# Altium schematic sheet Agilent_OCXO.SchDoc
size A3
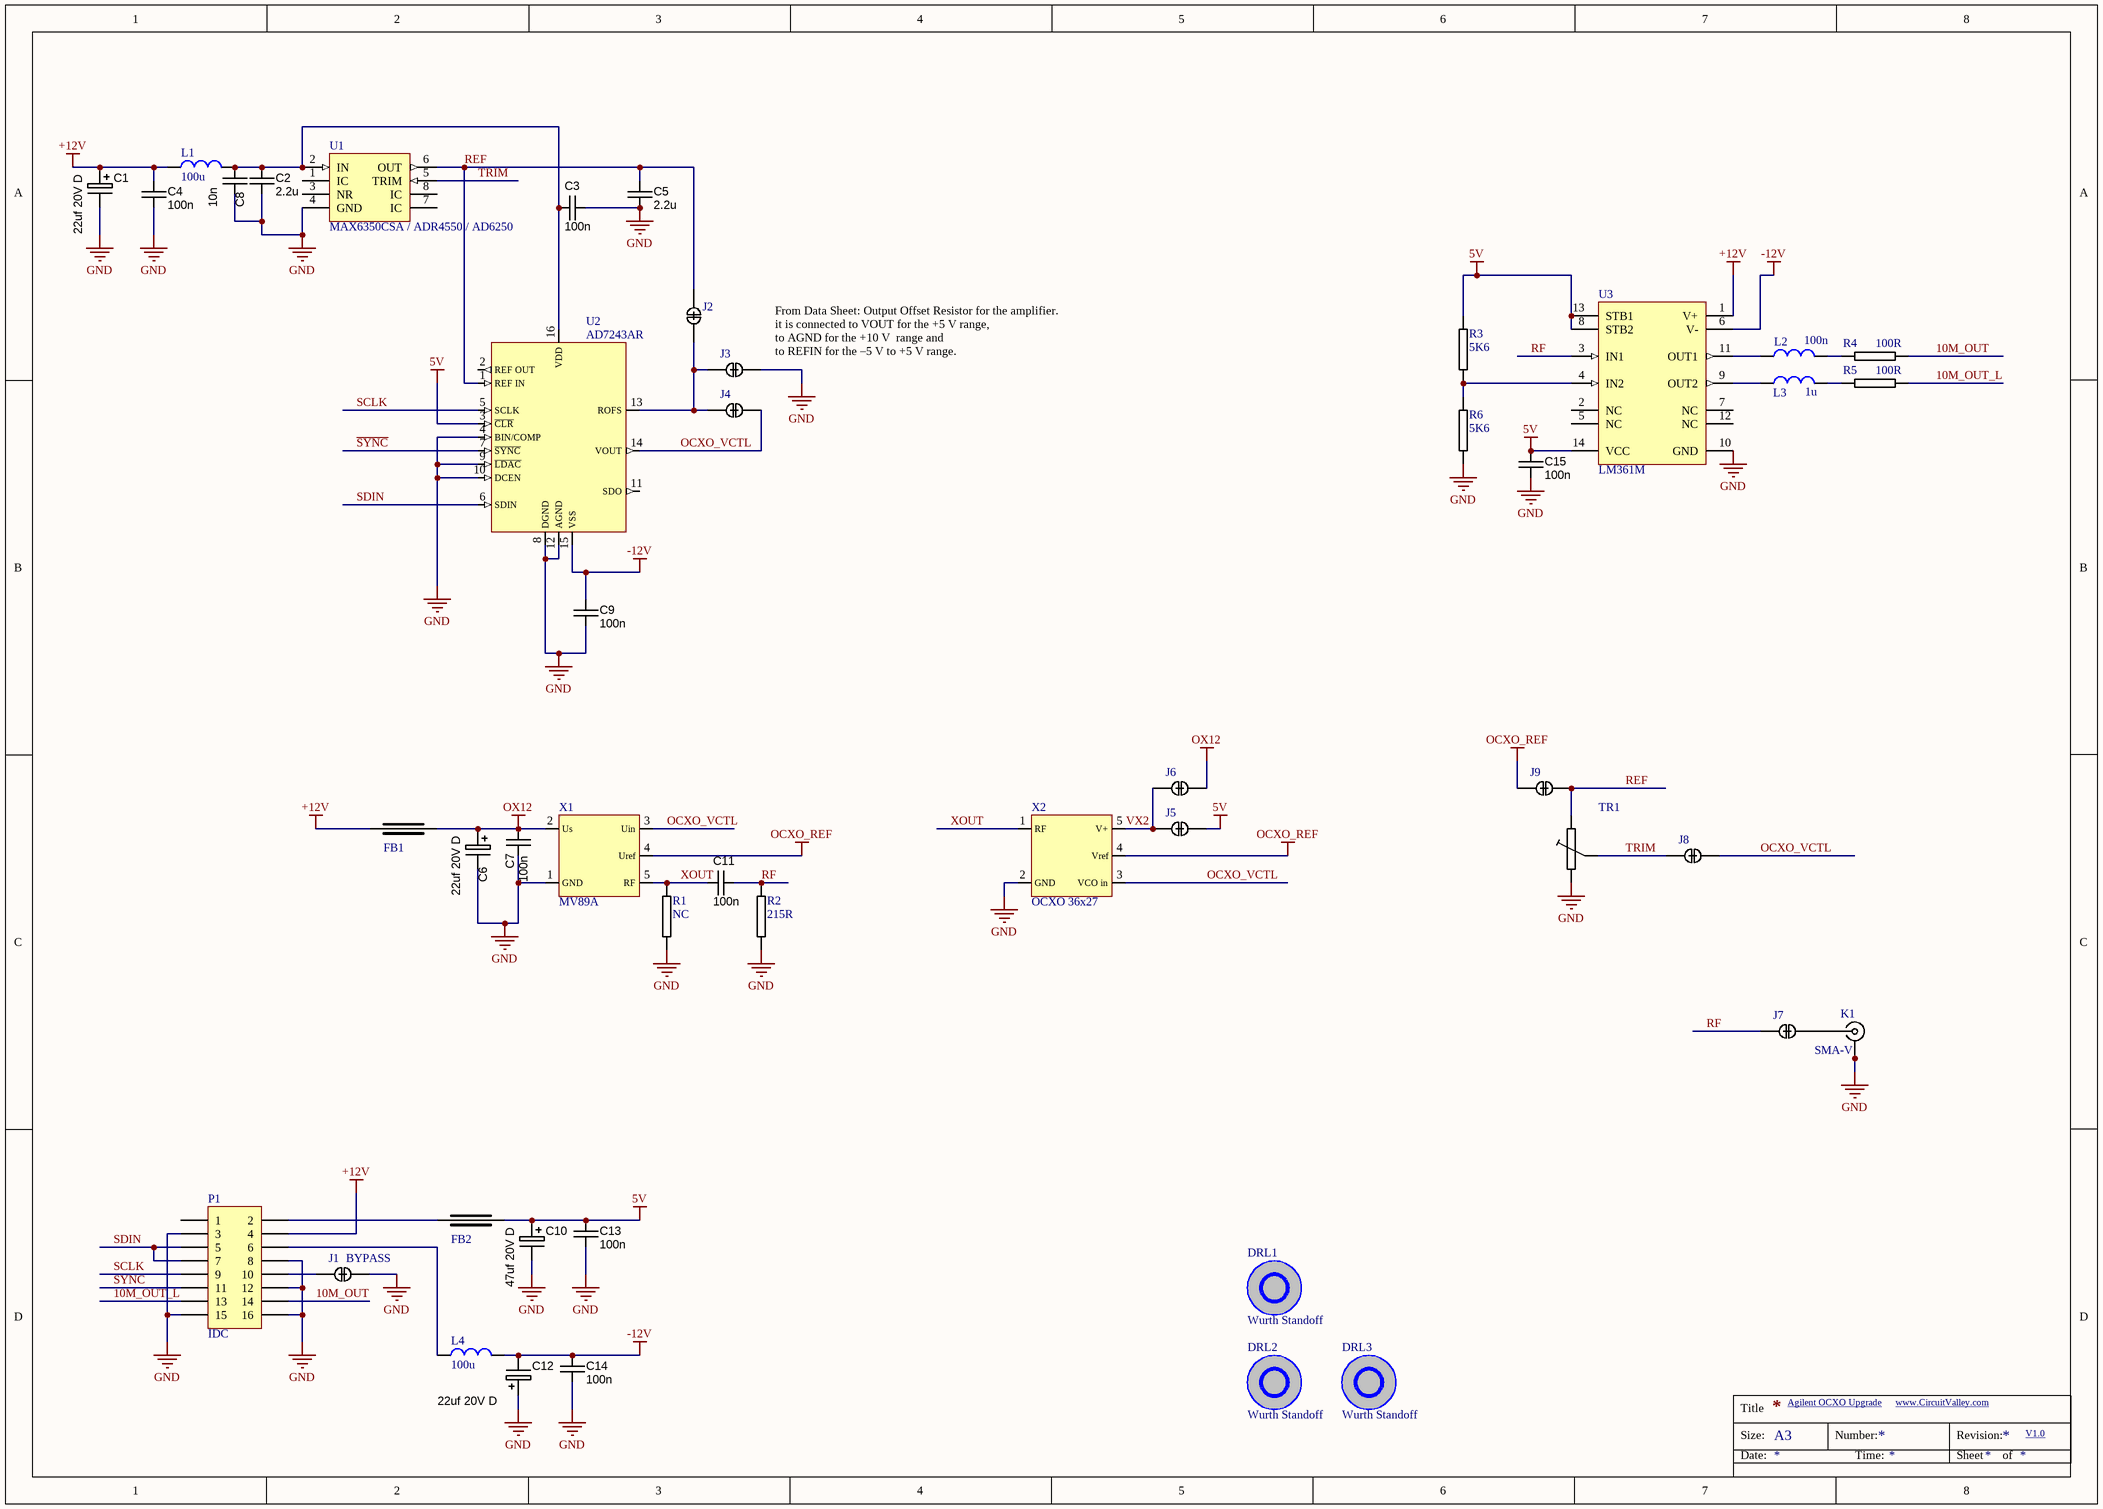
[diagram p0: Agilent_OCXO.SchDoc]

## Parts
C1  value 22uf 20V D  [CAPMP7343X310N]  (hidden comment: 47uf 20V D)
C2  2.2u  [CAPC1608N]
C3  100n  [CAPC1608N]
C4  100n  [CAPC1608N]
C5  2.2u  [CAPC1608N]
C6  value 22uf 20V D  [CAPMP7343X310N]  (hidden comment: 47uf 20V D)
C7  100n  [CAPC1608N]
C8  10n  [CAPC1608N]
C9  100n  [CAPC1608N]
C10  47uf 20V D  [CAPMP7343X310N]
C11  100n  [CAPC1608N]
C12  value 22uf 20V D  [CAPMP7343X310N]  (hidden comment: 47uf 20V D)
C13  100n  [CAPC1608N]
C14  100n  [CAPC1608N]
C15  100n  [CAPC1608N]
DRL1  Wurth Standoff  [Wurth_PCB_STANDOFF_7740_6mm]
DRL2  Wurth Standoff  [Wurth_PCB_STANDOFF_7740_6mm]
DRL3  Wurth Standoff  [Wurth_PCB_STANDOFF_7740_6mm]
FB1  (no value)  [0805FB-600Z]
FB2  (no value)  [0805FB-600Z]
J1  BYPASS  [BYPASS-MINI-CLOSED]
J2  (no value)  [BYPASS-CLOSED]
J3  (no value)  [BYPASS-CLOSED]
J4  (no value)  [BYPASS-CLOSED]
J5  (no value)  [BYPASS-CLOSED]
J6  (no value)  [BYPASS-CLOSED]
J7  (no value)  [BYPASS-CLOSED]
J8  (no value)  [BYPASS-CLOSED]
J9  (no value)  [BYPASS-CLOSED]
K1  SMA-V  [SMA-V]
L1  100u  [NLV32T]
L2  100n  [NLV32T]
L3  1u  [NLV32T]
L4  100u  [NLV32T]
P1  IDC  [HDR2X8]
R1  NC  [0805R-5K6]
R2  215R  [0805R-5K6]
R3  5K6  [0805R-5K6]
R4  100R  [0805R-100]
R5  100R  [0805R-100]
R6  5K6  [0805R-5K6]
TR1  (no value)  [TRIMMER-MT]
U1  MAX6350CSA / ADR4550 / AD6250  [NSO8_N]
U2  AD7243AR  [SOIC-16_WIDE]
U3  LM361M  [M14A_N]
X1  MV89A  [MV89A]
X2  OCXO 36x27  [OCXO_Small]

## Nets
5V: C10.1 C13.2 C15.2 FB2.2 J5.1 R3.1 U2.3(~{CLR}) U3.8(STB2) U3.13(STB1) U3.14(VCC)
+12V: C1.1 C4.2 FB1.1 L1.1 P1.4 U3.1(V+)
-12V: C9.2 C12.2 C14.2 L4.2 U2.15(VSS) U3.6(V-)
GND: C1.2 C2.1 C3.2 C4.1 C5.1 C6.2 C7.1 C8.1 C9.1 C10.2 C12.1 C13.1 C14.1 C15.1 J1.2 J3.1 K1.2 K1.3 K1.4 K1.5 P1.3 P1.8 P1.12 P1.15 P1.16 R1.2 R2.2 R6.2 TR1.1 U1.4(GND) U2.4(BIN/COMP) U2.8(DGND) U2.9(~{LDAC}) U2.10(DCEN) U2.12(AGND) U3.10(GND) X1.1(GND) X2.2(GND)
OCXO_REF: J9.2 X1.4(Uref) X2.4(Vref)
OX12: C6.1 C7.2 FB1.2 J6.1 X1.2(Us)
10M_OUT: P1.14 R4.2
10M_OUT_L: P1.13 R5.2
OCXO_VCTL: J4.1 J8.1 U2.14(VOUT) X1.3(Uin) X2.3(VCO_in)
REF: C5.2 J2.2 J9.1 TR1.2 U1.6(OUT) U2.1(REF_IN)
RF: C11.1 J7.2 R2.1 U3.3(IN1)
~{SYNC}: P1.11 U2.7(~{SYNC})
SCLK: P1.9 U2.5(SCLK)
SDIN: P1.5 P1.7 U2.6(SDIN)
TRIM: J8.2 TR1.W U1.5(TRIM)
VX2: J5.2 J6.2 X2.5(V+)
XOUT: C11.2 R1.1 X1.5(RF) X2.1(RF)
NetC2_2: C2.2 C3.1 C8.2 L1.2 U1.2(IN) U2.16(VDD)
NetFB2_1: FB2.1 P1.2
NetJ1_1: J1.1 P1.10
NetJ2_1: J2.1 J3.2 J4.2 U2.13(ROFS)
NetJ7_1: J7.1 K1.1
NetL2_1: L2.1 U3.11(OUT1)
NetL2_2: L2.2 R4.1
NetL3_1: L3.1 U3.9(OUT2)
NetL3_2: L3.2 R5.1
NetL4_1: L4.1 P1.6
NetR3_2: R3.2 R6.1 U3.4(IN2)

Not connected (* = marked no-connect by the designer): P1 1; U1 1(IC) 3(NR) 7(IC) 8(IC); U2 2(REF_OUT) 11(SDO); U3 2(NC) 5(NC) 7(NC) 12(NC)

## Notes on the sheet
- (near J3) From Data Sheet: Output Offset Resistor for the amplifier.
  it is connected to VOUT for the +5 V range,
  to AGND for the +10 V  range and
  to REFIN for the –5 V to +5 V range.
- Agilent OCXO Upgrade
- www.CircuitValley.com
- V1.0
- Title
- Size:
- Date:
- A3
- Number:
- Time:
- Revision:
- Sheet
- of

## Library data of the parts
C1 C6 C12 = CAPT_330u_2917_6V3: Capacitor SMD Tant 330uF 20% 6V3 2917; Manufacturer Part Number: T520D337M006ATE015; Part: TCJY226M025R0070; Ratings: 6.3V; Material: Solid Tantalum; ESR (Equivalent Series Resistance): 15 mOhm; Package / Case: 2917 (7343 Metric); Tolerance: ±20%; Operating Temperature: -55°C ~ 125°C; Size / Dimension: 0.287" L x 0.169" W (7.30mm x 4.30mm); Height - Seated (Max): 0.122" (3.10mm); Manufacturer Size Code: D; Supplier 1: Digi-Key; Supplier Part Number 1: 399-4052-1-ND; ComponentLink1URL: http://www.kemet.com/datasheets&T520D337M006ATE015; ComponentLink1Description: T520D Datasheet
C2 C5 = CAPC_10p_0603_NP0_1%_50V: Capacitor SMD Cer 10pF 5% 50V NP0 0603; Manufacturer 1: Murata Electronics North America; Manufacturer Part Number 1: GRM1885C1H100FA01J; Part: GRM188R6YA225KA12D; Ratings: 50V; NP0; Tolerance: ±5%; Operating Temperature: -55°C ~ 125°C; Package / Case: 0603 (1608 Metric); Size / Dimension: 0.063" L x 0.032" W (1.60mm x 0.81mm); Thickness (Max): 0.035" (0.90mm); Supplier 1: Digi-Key; Supplier Part Number 1: GRM1885C1H100FA01J-ND; Value: 2.2u
C3 C7 C9 C11 C13-C15 = CAPC_10p_0603_NP0_1%_50V: Capacitor SMD Cer 10pF 5% 50V NP0 0603; Manufacturer 1: Murata Electronics North America; Manufacturer Part Number 1: GRM1885C1H100FA01J; Part: C0603X104K5RAC; Ratings: 50V; NP0; Tolerance: ±5%; Operating Temperature: -55°C ~ 125°C; Package / Case: 0603 (1608 Metric); Size / Dimension: 0.063" L x 0.032" W (1.60mm x 0.81mm); Thickness (Max): 0.035" (0.90mm); Supplier 1: Digi-Key; Supplier Part Number 1: GRM1885C1H100FA01J-ND; Value: 100n
C4 = CAPC_10p_0603_NP0_1%_50V: Capacitor SMD Cer 10pF 5% 50V NP0 0603; Manufacturer 1: Murata Electronics North America; Manufacturer Part Number 1: GRM1885C1H100FA01J; Ratings: 50V; NP0; Tolerance: ±5%; Operating Temperature: -55°C ~ 125°C; Package / Case: 0603 (1608 Metric); Size / Dimension: 0.063" L x 0.032" W (1.60mm x 0.81mm); Thickness (Max): 0.035" (0.90mm); Supplier 1: Digi-Key; Supplier Part Number 1: GRM1885C1H100FA01J-ND; Value: 100n
C8 = CAPC_10p_0603_NP0_1%_50V: Capacitor SMD Cer 10pF 5% 50V NP0 0603; Manufacturer 1: Murata Electronics North America; Manufacturer Part Number 1: GRM1885C1H100FA01J; Part: C0603X103K5RAC; Ratings: 50V; NP0; Tolerance: ±5%; Operating Temperature: -55°C ~ 125°C; Package / Case: 0603 (1608 Metric); Size / Dimension: 0.063" L x 0.032" W (1.60mm x 0.81mm); Thickness (Max): 0.035" (0.90mm); Supplier 1: Digi-Key; Supplier Part Number 1: GRM1885C1H100FA01J-ND; Value: 10n
C10 = CAPT_330u_2917_6V3: Capacitor SMD Tant 330uF 20% 6V3 2917; Manufacturer Part Number: T520D337M006ATE015; Part: T495D476K020ATE175; Ratings: 6.3V; Material: Solid Tantalum; ESR (Equivalent Series Resistance): 15 mOhm; Package / Case: 2917 (7343 Metric); Tolerance: ±20%; Operating Temperature: -55°C ~ 125°C; Size / Dimension: 0.287" L x 0.169" W (7.30mm x 4.30mm); Height - Seated (Max): 0.122" (3.10mm); Manufacturer Size Code: D; Supplier 1: Digi-Key; Supplier Part Number 1: 399-4052-1-ND; ComponentLink1URL: http://www.kemet.com/datasheets&T520D337M006ATE015; ComponentLink1Description: T520D Datasheet; Value: 47uf 20V D
DRL1-DRL3 = PCB_Sandoff: Part: 9774050360
FB1 FB2 = 0805FB-600Z: FERRITE BEAD 600 OHM 2A; Part: ILHB0805ER300V; Reel: F5
J1 = BYPASS-MINI-CLOSED: SOLDERDOT BYPASS; Manufacturer Part Number 1: Board Feature; Reel: Closed; Supplier 1: Solder-it-yourself; Manufacturer 1: Board feature
J2-J9 = BYPASS-CLOSED: SOLDERDOT BYPASS; Manufacturer Part Number 1: Board Feature; Reel: Closed; Supplier 1: Solder-it-yourself; Manufacturer 1: Board feature
K1 = SMA-V: SMA THREADED RF CONNECTOR VERTICAL; Part: NC
L1 L4 = inductor_smd: Part: NLCV32T-101K-EF
L2 = inductor_smd: Part: NLV32T-R10J-EF
L3 = inductor_smd: Part: NLCV32T-1R0M-EF
P1 = Header 8X2: Header, 8-Pin, Dual row; Part: 75869303LF; LatestRevisionDate: 17-Jul-2002; LatestRevisionNote: Re-released for DXP Platform.; Publisher: Altium Limited
R1 = 0805R-5K6: RESISTOR 0805 1/4 WATT THIN FILM; Reel: *
R2 = 0805R-5K6: RESISTOR 0805 1/4 WATT THIN FILM; Part: RK73H2ATTD2150F; Reel: *
R3 R6 = 0805R-5K6: RESISTOR 0805 1/4 WATT THIN FILM; Part: RC0805FR-075K6L; Reel: *
R4 R5 = 0805R-100: RESISTOR 0805 1/4 WATT THIN FILM; Part: RK73H2ATTE1000F; Reel: *
TR1 = THTRIM-GENERIC: TRIMMABLE RESISTOR; Part: T93XA103KT20
U1 = MAX6350CSA: 1ppm/°C, Low-Noise, +5V Voltage Reference; Note: The IC pins are internally connected; do not use.; Published: 16-Jan-2001; LatestRevisionDate: 13-Apr-2006; LatestRevisionNote: IPC-7351 Footprint Added.; DatasheetVersion: Apr-1997; PackageReference: NSO8; Publisher: Altium Limited; PackageDescription: 8-Pin Small Outline Integrated Circuit 1.27 mm Pitch; Code_JEDEC: MS-012-AA; Code_IPC: SOIC127P600-8; ComponentLink1Description: Manufacturer Link; ComponentLink1URL: http://www.maxim-ic.com/; ComponentLink2Description: Datasheet; ComponentLink2URL: http://pdfserv.maxim-ic.com/en/ds/MAX6325-MAX6350.pdf; Part: MAX6350CSA
U2 = AD7243: Part: AD7243AR
U3 = LM361M: High Speed Differential Comparator, 14-pin Narrow SOIC; Manufacturer: National Semiconductor; PackageTopMarking: NSUZXYTTE#*LM361M; PowerWise: N; CompType: Amplifiers; Published: 4-Dec-2008; DatasheetVersion: Aug-2000; PackageVersion: revJ, Jan-1996; PackageReference: M14A; Publisher: Altium Limited; PackageDescription: Molded Package S.O., .150in Wide, 14 Lead; Supplier 1: Digi-Key; Supplier Part Number 1: LM361M-ND; Supplier 2: Farnell; Supplier Part Number 2: 6380414; PartNumber: LM361M; RoHS: N; PinCount: 14; Code_JEDEC: MS-012AB; Code_IPC: SOIC127P600-14; ComponentLink1Description: LM361 Datasheet; ComponentLink1URL: http://www.national.com/ds/LM/LM361.pdf; ComponentLink2Description: LM361 Web Page; ComponentLink2URL: http://www.national.com/pf/LM/LM361.html; ComponentLink3Description: M14A Package Page; ComponentLink3URL: http://www.national.com/packaging/folders/m14a.html; Part: LM361M
X1 = MV89A_OCXO: Part: MV89A
X2 = OCXO_Small_Bliey_6891_isotemp_ocxo131: Part: CTS 970